# EAGLE design Artembed_SMALL (EAGLE 9.5.0)
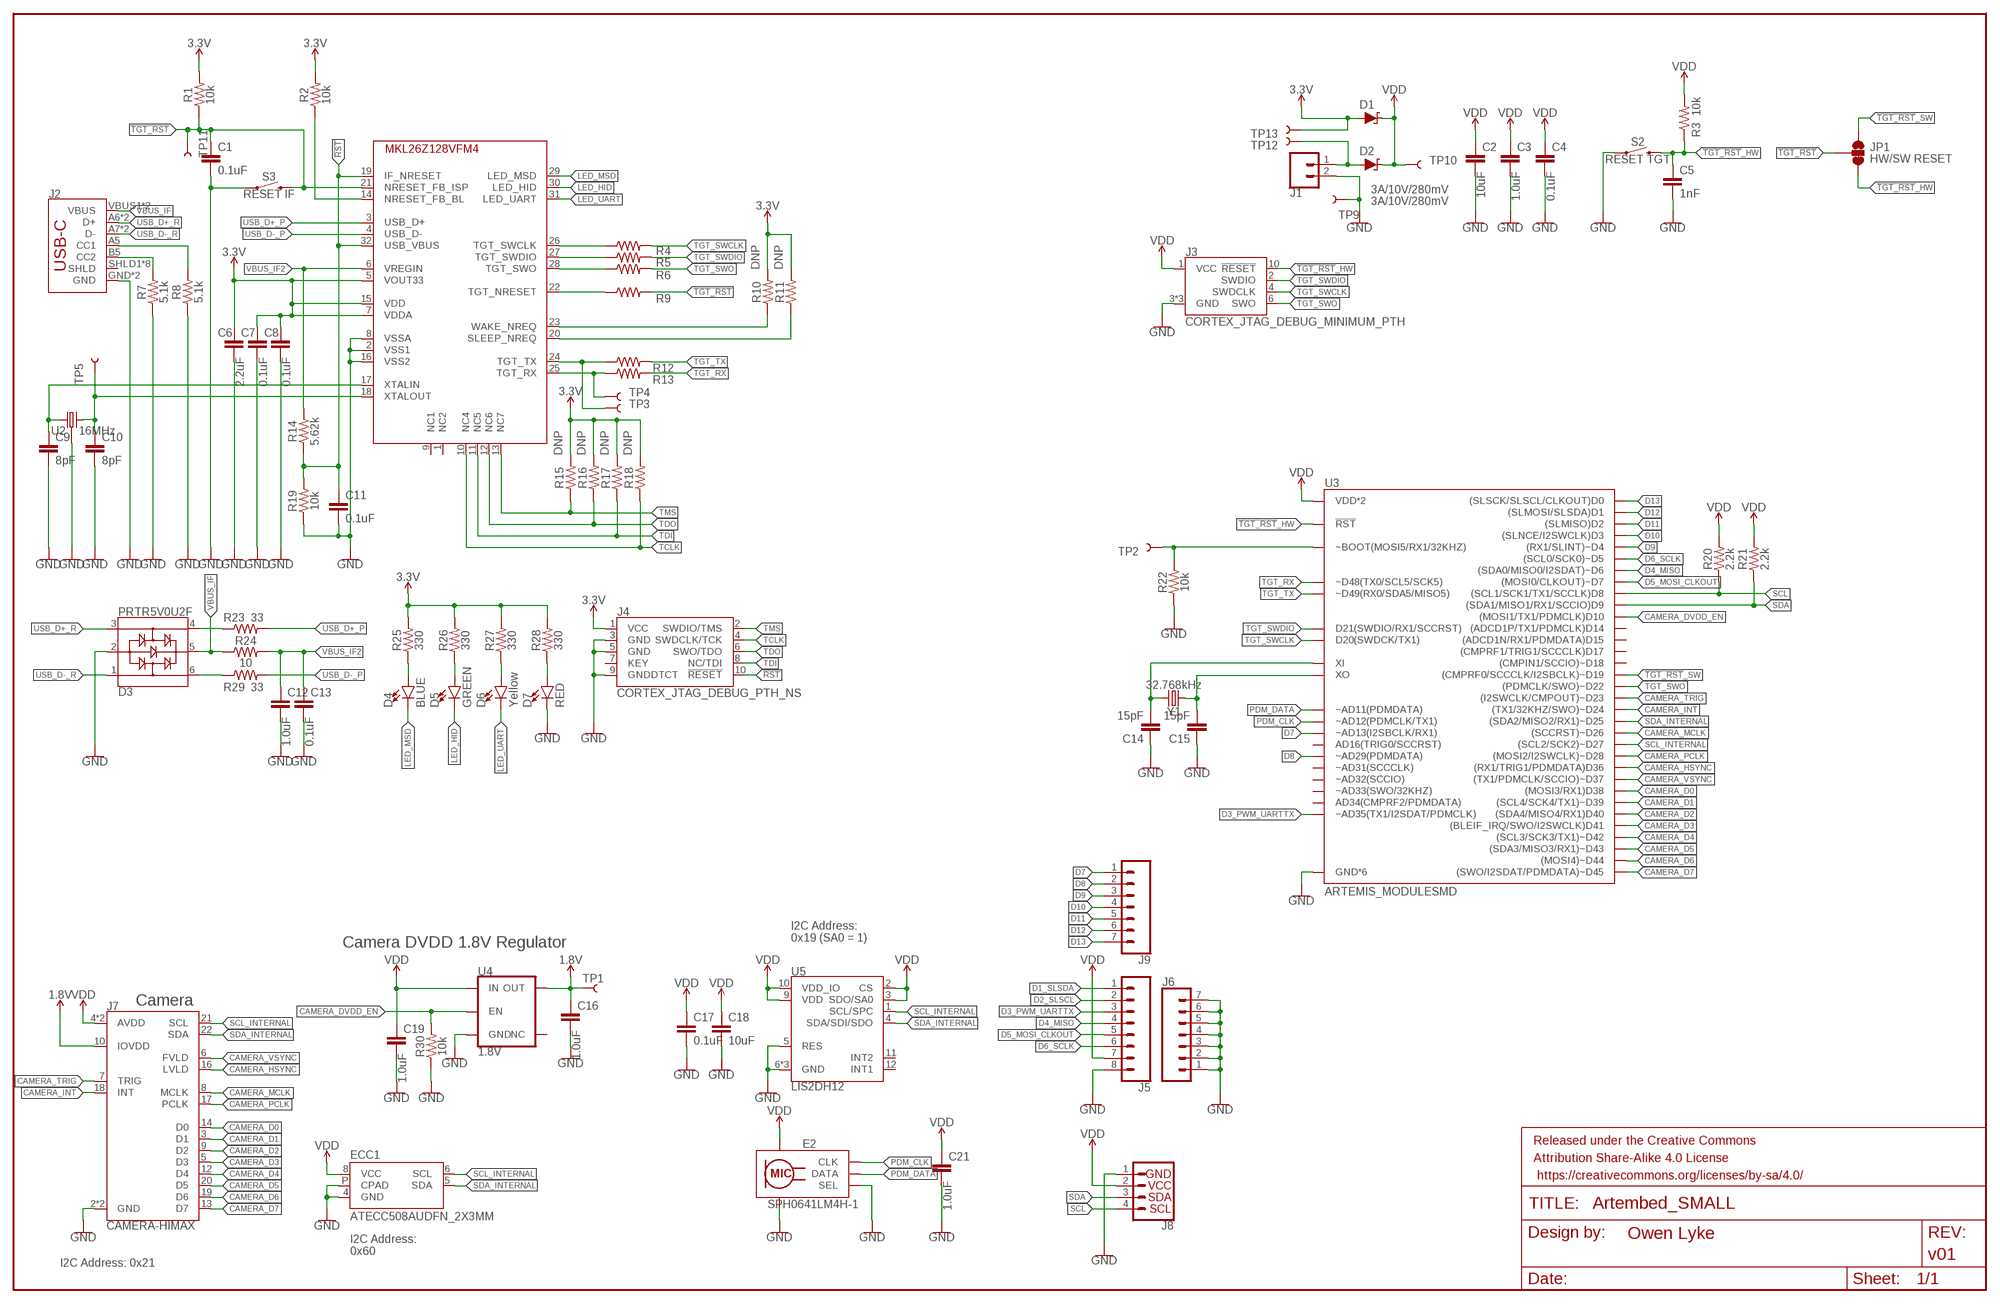
[diagram p0: schematic, sheet 1]

## Parts
C1  0.1uF  0.1UF-0603-25V-5%  [0603]
C2  10uF  10UF-0603-6.3V-20%  [0603]
C3  1.0uF  1.0UF-0603-16V-10%  [0603]
C4  0.1uF  0.1UF-0603-25V-5%  [0603]
C5  1nF  1.0NF/1000PF-0603-50V-10%  [0603]
C6  2.2uF  2.2UF-0603-10V-20%  [0603]
C7  0.1uF  0.1UF-0603-25V-5%  [0603]
C8  0.1uF  0.1UF-0603-25V-5%  [0603]
C9  8pF  CAP-0603  [0603]
C10  8pF  CAP-0603  [0603]
C11  0.1uF  0.1UF-0603-25V-5%  [0603]
C12  1.0uF  1.0UF-0603-16V-10%  [0603]
C13  0.1uF  0.1UF-0603-25V-5%  [0603]
C14  15pF  15PF-0603-50V-5%  [0603]
C15  15pF  15PF-0603-50V-5%  [0603]
C16  1.0uF  1.0UF-0603-16V-10%  [0603]
C17  0.1uF  0.1UF-0603-25V-5%  [0603]
C18  10uF  10UF-0603-6.3V-20%  [0603]
C19  1.0uF  1.0UF-0603-16V-10%  [0603]
C21  1.0uF  1.0UF-0603-16V-10%  [0603]
D1  3A/10V/280mV  DIODE-SCHOTTKY-BAT60A  [SOD-323]
D2  3A/10V/280mV  DIODE-SCHOTTKY-BAT60A  [SOD-323]
D3  PRTR5V0U2F  [SOT886]
D4  BLUE  LED-BLUE0603  [LED-0603]
D5  GREEN  LED-GREEN0603  [LED-0603]
D6  Yellow  LED-YELLOW0603  [LED-0603]
D7  RED  LED-RED0603  [LED-0603]
E2  SPH0641LM4H-1  SPH0641LM4H-1_MICROPHONE  [SPH0641LM4H-1_MICROPHONE]
ECC1  ATECC508AUDFN_2X3MM  [UDFN_2X3MM]
FRAME1  FRAME-LEDGER  [CREATIVE_COMMONS]
J1  CONN_02-JST-2MM-SMT  [JST-2-SMD]
J2  USB_C2-LAYER  [USB-C-16P]
J3  CORTEX_JTAG_DEBUG_MINIMUM_PTH  [2X5-PTH-1.27MM]
J4  CORTEX_JTAG_DEBUG_PTH_NS  [2X5-PTH-1.27MM-NO_SILK]
J5  CONN_08NO_SILK_FEMALE_PTH  [1X08_NO_SILK]
J6  CONN_07NO_SILK  [1X07_NO_SILK]
J7  CAMERA-HIMAX  [FPC-24-AMPHENOL-SFV24R-1STE1HLF]
J8  QWIIC_CONNECTORJS-1MM  [JST04_1MM_RA]
J9  CONN_07NO_SILK  [1X07_NO_SILK]
JP1  HW/SW RESET  JUMPER-SMT_3_1-NC_TRACE_SILK  [SMT-JUMPER_3_1-NC_TRACE_SILK]
R1  10k  10KOHM-0603-1/10W-1%  [0603]
R2  10k  10KOHM-0603-1/10W-1%  [0603]
R3  10k  10KOHM-0603-1/10W-1%  [0603]
R4  0  0OHM-0603-1/10W  [0603]
R5  0  0OHM-0603-1/10W  [0603]
R6  0  0OHM-0603-1/10W  [0603]
R7  5.1k  5.1KOHM5.1KOHM-0603-1/10W-1%  [0603]
R8  5.1k  5.1KOHM5.1KOHM-0603-1/10W-1%  [0603]
R9  0  0OHM-0603-1/10W  [0603]
R10  DNP  RESISTOR0603  [0603]
R11  DNP  RESISTOR0603  [0603]
R12  0  0OHM-0603-1/10W  [0603]
R13  0  0OHM-0603-1/10W  [0603]
R14  5.62k  5.62KOHM-0603-1/10W-1%  [0603]
R15  DNP  RESISTOR0603  [0603]
R16  DNP  RESISTOR0603  [0603]
R17  DNP  RESISTOR0603  [0603]
R18  DNP  RESISTOR0603  [0603]
R19  10k  10KOHM-0603-1/10W-1%  [0603]
R20  2.2k  2.2KOHM-0603-1/10W-1%  [0603]
R21  2.2k  2.2KOHM-0603-1/10W-1%  [0603]
R22  10k  10KOHM-0603-1/10W-1%  [0603]
R23  33  33OHM-0603-1/10W-1%  [0603]
R24  10  10OHM-0603-1/10W-1%  [0603]
R25  330  330OHM-0603-1/10W-1%  [0603]
R26  330  330OHM-0603-1/10W-1%  [0603]
R27  330  330OHM-0603-1/10W-1%  [0603]
R28  330  330OHM-0603-1/10W-1%  [0603]
R29  33  33OHM-0603-1/10W-1%  [0603]
R30  10k  10KOHM-0603-1/10W-1%  [0603]
S2  RESET TGT  MOMENTARY-SWITCH-SPST-SMD-4.6X2.8MM  [TACTILE_SWITCH_SMD_4.6X2.8MM]
S3  RESET IF  MOMENTARY-SWITCH-SPST-SMD-4.6X2.8MM  [TACTILE_SWITCH_SMD_4.6X2.8MM]
TP1  TEST-POINT3X5  [PAD.03X.05]
TP2  TEST-POINT3X5  [PAD.03X.05]
TP3  TEST-POINT3X5  [PAD.03X.05]
TP4  TEST-POINT3X5  [PAD.03X.05]
TP5  TEST-POINT3X5  [PAD.03X.05]
TP9  TEST-POINT3X5  [PAD.03X.05]
TP10  TEST-POINT3X5  [PAD.03X.05]
TP11  TEST-POINT3X5  [PAD.03X.05]
TP12  TEST-POINT3X5  [PAD.03X.05]
TP13  TEST-POINT3X5  [PAD.03X.05]
U1  DAPLINK_KL26Z  [QFN-32-NOPAD]
U2  16MHz  CRYSTAL-16MHZ_SMALL  [CRYSTAL-SMD-3.2X2.5MM]
U3  ARTEMIS_MODULESMD  [ARTEMIS_FP]
U4  1.8V  V_REG_AP2127K-1.8V  [SOT23-5]
U5  LIS2DH12  [LGA-12-LISDH12]
Y1  32.768kHz  CRYSTAL-32.768KHZSMD-3.2X1.5  [CRYSTAL-SMD-3.2X1.5MM]

## Nets
1.8V: C16.1 J7.10(IOVDD) TP1.P$1 U4.5(OUT)
3.3V: C6.1 C7.1 C8.1 D1.A J4.1(VCC) R1.2 R2.2 R10.2 R11.2 R15.2 R16.2 R17.2 R18.2 R25.2 R26.2 R27.2 R28.2 TP13.P$1 U1.5(VOUT33) U1.7(VDDA) U1.15(VDD)
!RST: C11.1 J4.10(!RESET) R14.1 R19.2 U1.19(IF_NRESET) U1.32(USB_VBUS)
!TGT_RST: C1.1 JP1.2 R1.1 R9.2 S3.3 S3.4 TP11.P$1 U1.21(NRESET_FB_ISP)
!TGT_RST!_HW: C5.1 J3.10(!RESET) JP1.3 R3.1 S2.3 S2.4 U3.~RST(!RST)
!TGT_RST!_SW: JP1.1 U3.~D19((CMPRF0/SCCCLK/I2SBCLK)~D19)
CAMERA_D0: J7.14(D0) U3.D38((MOSI3/RX1)D38)
CAMERA_D1: J7.3(D1) U3.~D39((SCL4/SCK4/TX1)~D39)
CAMERA_D2: J7.9(D2) U3.D40((SDA4/MISO4/RX1)D40)
CAMERA_D3: J7.5(D3) U3.D41((BLEIF_IRQ/SWO/I2SWCLK)D41)
CAMERA_D4: J7.12(D4) U3.~D42((SCL3/SCK3/TX1)~D42)
CAMERA_D5: J7.20(D5) U3.~D43((SDA3/MISO3/RX1)~D43)
CAMERA_D6: J7.19(D6) U3.~D44((MOSI4)~D44)
CAMERA_D7: J7.13(D7) U3.~D45((SWO/I2SDAT/PDMDATA)~D45)
CAMERA_DVDD_EN: R30.2 U3.D10((MOSI1/TX1/PDMCLK)D10) U4.3(EN)
CAMERA_HSYNC: J7.16(LVLD) U3.D36((RX1/TRIG1/PDMDATA)D36)
CAMERA_INT: J7.18(INT) U3.~D24((TX1/32KHZ/SWO)~D24)
CAMERA_MCLK: J7.8(MCLK) U3.~D26((SCCRST)~D26)
CAMERA_PCLK: J7.17(PCLK) U3.~D28((MOSI2/I2SWCLK)~D28)
CAMERA_TRIG: J7.7(TRIG) U3.~D23((I2SWCLK/CMPOUT)~D23)
CAMERA_VSYNC: J7.6(FVLD) U3.~D37((TX1/PDMCLK/SCCIO)~D37)
D1_SLSDA: J5.1
D2_SLSCL: J5.2
D3_PWM_UARTTX: J5.3 U3.~AD35(~AD35(TX1/I2SDAT/PDMCLK))
D4_MISO: J5.4 U3.~D6((SDA0/MISO0/I2SDAT)~D6)
D5_MOSI_CLKOUT: J5.5 U3.D7((MOSI0/CLKOUT)~D7)
D6_SCLK: J5.6 U3.~D5((SCL0/SCK0)~D5)
D7: J9.1 U3.~AD13(~AD13(I2SBCLK/RX1))
D8: J9.2 U3.~AD29(~AD29(PDMDATA))
D9: J9.3 U3.~D4((RX1/SLINT)~D4)
D10: J9.4 U3.D3((SLNCE/I2SWCLK)D3)
D11: J9.5 U3.D2((SLMISO)D2)
D12: J9.6 U3.D1((SLMOSI/SLSDA)D1)
D13: J9.7 U3.D0((SLSCK/SLSCL/CLKOUT)D0)
GND: C1.2 C2.2 C3.2 C4.2 C5.2 C6.2 C7.2 C8.2 C9.2 C10.2 C11.2 C12.2 C13.2 C14.1 C15.1 C16.2 C17.2 C18.2 C19.2 C21.2 D3.2 D7.C E2.2(SEL) E2.3(GND) E2.6(GND) E2.7(GND) E2.8(GND) ECC1.4(GND) ECC1.P(CPAD) J1.2 J2.GND J2.GND2(GND) J3.3(GND) J3.5(GND) J3.9(GND) J4.3(GND) J4.5(GND) J4.9(GNDDTCT) J5.8 J6.1 J6.2 J6.3 J6.4 J6.5 J6.6 J6.7 J7.2(GND) J7.15(GND) J8.1 R7.1 R8.1 R19.1 R22.1 R30.1 S2.1 S2.2 S3.1 S3.2 TP9.P$1 U1.2(VSS1) U1.8(VSSA) U1.16(VSS2) U2.2(GND) U2.4(GND) U3.GND@1(GND*6) U3.GND@22(GND*6) U3.GND@38(GND*6) U3.GND@39(GND*6) U3.GND@47(GND*6) U3.GND@59(GND*6) U4.2(GND) U5.5(RES) U5.6(GND) U5.7(GND) U5.8(GND)
LED_HID: D5.C U1.30(LED_HID)
LED_MSD: D4.C U1.29(LED_MSD)
LED_UART: D6.C U1.31(LED_UART)
N$1: D4.A R25.1
N$2: D5.A R26.1
N$3: D6.A R27.1
N$4: J2.B5(CC2) R7.2
N$5: J2.A5(CC1) R8.2
N$7: D7.A R28.1
N$8: D3.4 R23.1
N$9: D3.6 R29.1
N$10: R2.1 U1.14(NRESET_FB_BL)
N$11: R11.1 U1.20(SLEEP_NREQ)
N$13: C9.1 U1.17(XTALIN) U2.1
N$14: C14.2 U3.XI Y1.P$2
N$15: C15.2 U3.XO Y1.P$1
N$16: C10.1 TP5.P$1 U1.18(XTALOUT) U2.3
N$17: R12.1 TP3.P$1 U1.24(TGT_TX)
N$18: R13.1 TP4.P$1 U1.25(TGT_RX)
N$19: R10.1 U1.23(WAKE_NREQ)
N$20: R22.2 TP2.P$1 U3.BOOT(~BOOT(MOSI5/RX1/32KHZ))
N$21: D2.A J1.1 TP12.P$1
N$22: R9.1 U1.22(TGT_NRESET)
N$23: R4.1 U1.26(TGT_SWCLK)
N$24: R5.1 U1.27(TGT_SWDIO)
N$25: R6.1 U1.28(TGT_SWO)
PDM_CLK: E2.4(CLK) U3.~AD12(~AD12(PDMCLK/TX1))
PDM_DATA: E2.1(DATA) U3.~AD11(~AD11(PDMDATA))
SCL: J8.4 R20.1 U3.D8((SCL1/SCK1/TX1/SCCLK)D8)
SCL_INTERNAL: ECC1.6(SCL) J7.21(SCL) U3.~D27((SCL2/SCK2)~D27) U5.1(SCL/SPC)
SDA: J8.3 R21.1 U3.D9((SDA1/MISO1/RX1/SCCIO)D9)
SDA_INTERNAL: ECC1.5(SDA) J7.22(SDA) U3.~D25((SDA2/MISO2/RX1)~D25) U5.4(SDA/SDI/SDO)
TCLK: J4.4(SWDCLK/TCK) R18.1 U1.10(NC4)
TDI: J4.8(NC/TDI) R17.1 U1.11(NC5)
TDO: J4.6(SWO/TDO) R16.1 U1.12(NC6)
TGT_RX: R13.2 U3.TXO-0(~D48(TX0/SCL5/SCK5))
TGT_SWCLK: J3.4(SWDCLK) R4.2 U3.SWDCK(D20(SWDCK/TX1))
TGT_SWDIO: J3.2(SWDIO) R5.2 U3.SWDIO(D21(SWDIO/RX1/SCCRST))
TGT_SWO: J3.6(SWO) R6.2 U3.~D22((PDMCLK/SWO)~D22)
TGT_TX: R12.2 U3.RXI-0(~D49(RX0/SDA5/MISO5))
TMS: J4.2(SWDIO/TMS) R15.1 U1.13(NC7)
USB_D+_P: R23.2 U1.3(USB_D+)
USB_D+_R: D3.3 J2.A6(D+) J2.B6(D+)
USB_D-_P: R29.2 U1.4(USB_D-)
USB_D-_R: D3.1 J2.A7(D-) J2.B7(D-)
VBUS_IF: D3.5 J2.VBUS1(VBUS) J2.VBUS2(VBUS) R24.1
VBUS_IF2: C12.1 C13.1 R14.2 R24.2 U1.6(VREGIN)
VDD: C2.1 C3.1 C4.1 C17.1 C18.1 C19.1 C21.1 D1.C D2.C E2.5(VDD) ECC1.8(VCC) J3.1(VCC) J5.7 J7.4(AVDD) J7.11(AVDD) J8.2 R3.2 R20.2 R21.2 TP10.P$1 U3.VDD@36(VDD*2) U3.VDD@37(VDD*2) U4.1(IN) U5.2(CS) U5.3(SDO/SA0) U5.9(VDD) U5.10(VDD_IO)
Unconnected: J2.SHLD1(SHLD) J2.SHLD2(SHLD) J2.SHLD3(SHLD) J2.SHLD4(SHLD) J2.SHLD5(SHLD) J2.SHLD6(SHLD) J2.SHLD7(SHLD) J2.SHLD8(SHLD) J4.7(KEY) J7.MNT1@0(MNT1) J7.MNT1@1(MNT1) J7.MNT2@0(MNT2) J7.MNT2@1(MNT2) U1.1(NC2) U1.9(NC1) U3.AD16(AD16(TRIG0/SCCRST)) U3.AD34(AD34(CMPRF2/PDMDATA)) U3.D14((ADCD1P/TX1/PDMCLK)D14) U3.D15((ADCD1N/RX1/PDMDATA)D15) U3.D17((CMPRF1/TRIG1/SCCCLK)D17) U3.~AD31(~AD31(SCCCLK)) U3.~AD32(~AD32(SCCIO)) U3.~AD33/SWO(~AD33(SWO/32KHZ)) U3.~D18((CMPIN1/SCCIO)~D18) U4.4(NC) U5.11(INT2) U5.12(INT1)

## Notes on the sheet
- Camera DVDD 1.8V Regulator
- I2C Address:
  0x19 (SA0 = 1)
- Camera
- I2C Address:
  0x60
- I2C Address: 0x21

## Library data of the parts
C1 C4 C7 C8 C11 C13 C17 = SparkFun-Capacitors:0.1UF: 0.1µF ceramic capacitors A capacitor is a passive two-terminal electrical component used to store electrical energy temporarily in an electric field.; PROD_ID: CAP-08604
C2 C18 = SparkFun-Capacitors:10UF: 10.0µF ceramic capacitors A capacitor is a passive two-terminal electrical component used to store electrical energy temporarily in an electric field.; PROD_ID: CAP-11015
C3 C12 C16 C19 C21 = SparkFun-Capacitors:1.0UF: 1µF ceramic capacitors A capacitor is a passive two-terminal electrical component used to store electrical energy temporarily in an electric field.; PROD_ID: CAP-00868
C5 = SparkFun-Capacitors:1.0NF/1000PF: 1nF/1,000pF ceramic capacitors A capacitor is a passive two-terminal electrical component used to store electrical energy temporarily in an electric field.; PROD_ID: CAP-07886
C6 = SparkFun-Capacitors:2.2UF: 2.2µF ceramic capacitors A capacitor is a passive two-terminal electrical component used to store electrical energy temporarily in an electric field.; PROD_ID: CAP-07888
C9 C10 = SparkFun-Capacitors:CAP
C14 C15 = SparkFun-Capacitors:15PF: 15pF ceramic capacitors A capacitor is a passive two-terminal electrical component used to store electrical energy temporarily in an electric field.; PROD_ID: CAP-07881
D1 D2 = SparkFun-DiscreteSemi:DIODE-SCHOTTKY: Schottky diode A Schottky diode is a semiconductor diode which has a low forward voltage drop and a very fast switching action.; PROD_ID: DIO-14072
D3 = SparkFun-IC-Power:PRTR5V0U2: A small ESD protection device. Most commonly used on USB D+/D- signals to protect large, expensive, or especially sensitive USB enabled devices.; PROD_ID: DIO-14084
D4 = SparkFun-LED:LED-BLUE: Blue SMD LED Used in manufacturing of various products at SparkFun Packages: 0603 - SMD 0603 package [Product Link] <http://www.digikey.com/product-detail/en/SMLE12BC7TT86/511-1589-2-ND/1641808> 1206 - SMD1206 package [Product Link] <http://www.digikey.com/product-detail/en/lite-on-inc/LTST-C150TBKT/160-1643-1-ND/573584> SparkFun Products: ESP8266 Thing-Dev Board <https://www.sparkfun.com/products/13711> RedBoard <https://www.sparkfun.com/products/12757>; PROD_ID: DIO-08575
D5 = SparkFun-LED:LED-GREEN: Green SMD LED Used in manufacturing of various products at SparkFun Packages: 0603 - SMD 0603 package [Product Link] <http://www.futureelectronics.com/en/technologies/semiconductors/optoelectronics/leds/Pages/9894312-LTST-C190GKT.aspx?CrossPart=HSMG-C190&IM=0> LilyPad 1206 - SMD1206 LilyPad package [Product Link] <http://www.futureelectronics.com/en/Technologies/Product.aspx?ProductID=IN150NGHARVATEKCORPORATION2049943&IM=0> 1206 - SMD1206 package [Product Link] <http://www.futureelectronics.com/en/technologies/semiconductors/optoelectronics/leds/Pages/8315665-LTST-C150KGKT.aspx?IM=0> 1206 Bottom Mount -SMD 1206 Bottom Mount [Product Link] <http://www.digikey.com/product-detail/en/lite-on-inc/LTST-C230KGKT/160-1456-1-ND/386854> SparkFun Products: Pro Mini 328 -5V <https://www.sparkfun.com/products/821> RedBoard <https://www.sparkfun.com/products/12757> MP3 Trigger <https://www.sparkfun.com/products/13720> Makey Makey <https://www.sparkfun.com/products/11076>; PROD_ID: DIO-00821
D6 = SparkFun-LED:LED-YELLOW: Yellow SMD LED Used in manufacturing several products at SparkFun. Packages: 0603 - SMD 0603 package[Product Link] <http://www.kingbrightusa.com/product.asp?catalog_name=LED&product_id=APT1608SYCK> 0603 -SMART - SMART SMD 0603 package (more efficient/more expensive) [Product Link] <http://www.osram-os.com/osram_os/en/products/product-catalog/led-light-emitting-diodes/smartled-0603/ly-l29k/index.jsp> LilyPad - SMD1206 package[Product Datasheet] <https://www.sparkfun.com/datasheets/DevTools/LilyPad/Q150YUS4.pdf> SparkFun Products: Blynk Board <https://www.sparkfun.com/products/13794> IOIO-OTG <https://www.sparkfun.com/products/13613> XBee Explorer Serial <https://www.sparkfun.com/products/13225>; PROD_ID: DIO-09003
D7 = SparkFun-LED:LED-RED: Red SMD LED Used in manufacturing of most products at SparkFun Packages: 0603 - SMD 0603 package [Product Link] <http://docs.avagotech.com/docs/AV02-0551EN> 0603 SMART - SMD 0603 SMART package ( more efficient and expensive)[Product Link] <http://www.osram-os.com/Graphics/XPic2/00077099_0.pdf> 1206 - SMD1206 package [Product Link] <https://www.sparkfun.com/datasheets/DevTools/LilyPad/Q150OVS4.pdff> SparkFun Products: Pro Mini 328 -5V <https://www.sparkfun.com/products/821> RedBoard <https://www.sparkfun.com/products/12757> IOIO-OTG <https://www.sparkfun.com/products/13613>; PROD_ID: DIO-00819
E2 = SparkFun-Sensors:SPH0641LM4H-1_MICROPHONE: SPH0641LM4H-1 Microphone A miniature, high-performance, low power, bottom port silicon digital microphone with a single bit PDM output.; PROD_ID: IC-14361
ECC1 = ATECC508A:ATECC508A: ATECC508A CryptoAuthentication Device Cryptographic Co-processor with Secure Hardware-Based Key Storage ECDSA: FIPS186-3 Elliptic Curve Digital Signature Algorithm ECDH: FIPS SP800-56A Elliptic Curve Diffie-Hellman Algorithm NIST Standard P256 Elliptic Curve Support SHA-256 Hash Algorithm with HMAC Option 1 MHz Standard I2C Interface 2.0V to 5.5V Supply Voltage Range 1.8V to 5.5V IO levels Datasheet <http://ww1.microchip.com/downloads/en/DeviceDoc/20005927A.pdf> SparkFun Products Qwiic IoT Security ATECC508A <https://www.sparkfun.com/products/XXXXX> (DEV-XXXXX)
FRAME1 = SparkFun-Aesthetics:FRAME-LEDGER: Schematic Frame - Ledger Standard 11x14 US Ledger frame; DESIGNER: Owen Lyke; REV: v01
J1 = SparkFun-Connectors:CONN_02: Multi connection point. Often used as Generic Header-pin footprint for 0.1 inch spaced/style header connections On any of the 0.1 inch spaced packages, you can populate with these: Break Away Headers - Straight <https://www.sparkfun.com/products/116> (PRT-00116) Break Away Male Headers - Right Angle <https://www.sparkfun.com/products/553> (PRT-00553) Female Headers <https://www.sparkfun.com/products/115> (PRT-00115) Break Away Headers - Machine Pin <https://www.sparkfun.com/products/117> (PRT-00117) Break Away Female Headers - Swiss Machine Pin <https://www.sparkfun.com/products/743> (PRT-00743) For SCREWTERMINALS and SPRING TERMINALS visit here: Screw Terimnals on SparkFun.com <https://www.sparkfun.com/search/results?term=Screw+Terminals> (5mm/3.5mm/2.54mm spacing) This device is also useful as a general connection point to wire up your design to another part of your project. Our various solder wires solder well into these plated through hole pads. Hook-Up Wire - Assortment (Stranded, 22 AWG) <https://www.sparkfun.com/products/11375> (PRT-11375) Hook-Up Wire - Assortment (Solid Core, 22 AWG) <https://www.sparkfun.com/products/11367> (PRT-11367) View the entire wire category on our website here <https://www.sparkfun.com/categories/141> Special notes: Molex polarized connector foot print use with: PRT-08233 with associated crimp pins and housings. 2.54_SCREWTERM for use with PRT-10571. 3.5mm Screw Terminal footprints for PRT-08084 5mm Screw Terminal footprints for use with PRT-08432; PROD_ID: CONN-11443
J2 = SparkFun-Connectors:USB_C: USB Type C 16Pin Connector Super Speed pins not available on the 16-pin purely SMD connector so this part is best for USB 2.0 implementations. D1 and D2 are tied together enabling D+/- no matter which way the cable is plugged into the connector. The two channel configuration pins (CC1/2) are exposed. These are normally connected to ground via 5.1k resistors but can be reconfigured for high current/high power applications.; PROD_ID: CONN-14122
J3 = SparkFun-Connectors:CORTEX_JTAG_DEBUG_MINIMUM: Cortex Debug Connector - 10 pin Supports JTAG debug, Serial Wire debug, and Serial Wire Viewer. PTH and SMD connector options available. General Connector Information <http://infocenter.arm.com/help/topic/com.arm.doc.faqs/attached/13634/cortex_debug_connectors.pdf> Products: PTH Connector <http://www.digikey.com/product-detail/en/cnc-tech/3220-10-0100-00/1175-1627-ND/3883661> -via Digi-Key SparkFun PSoc <https://www.sparkfun.com/products/13229> SparkFun T <https://www.sparkfun.com/products/13810>
J4 = SparkFun-Connectors:CORTEX_JTAG_DEBUG: Cortex Debug Connector - 10 pin Supports JTAG debug, Serial Wire debug, and Serial Wire Viewer. PTH and SMD connector options available. General Connector Information <http://infocenter.arm.com/help/topic/com.arm.doc.faqs/attached/13634/cortex_debug_connectors.pdf> Products: PTH Connector <http://www.digikey.com/product-detail/en/cnc-tech/3220-10-0100-00/1175-1627-ND/3883661> -via Digi-Key SparkFun PSoc <https://www.sparkfun.com/products/13229> SparkFun T <https://www.sparkfun.com/products/13810>
J5 = SparkFun-Connectors:CONN_08: Multi connection point. Often used as Generic Header-pin footprint for 0.1 inch spaced/style header connections On any of the 0.1 inch spaced packages, you can populate with these: Break Away Headers - Straight <https://www.sparkfun.com/products/116> (PRT-00116) Break Away Male Headers - Right Angle <https://www.sparkfun.com/products/553> (PRT-00553) Female Headers <https://www.sparkfun.com/products/115> (PRT-00115) Break Away Headers - Machine Pin <https://www.sparkfun.com/products/117> (PRT-00117) Break Away Female Headers - Swiss Machine Pin <https://www.sparkfun.com/products/743> (PRT-00743) Arduino Stackable Header - 8 Pin <https://www.sparkfun.com/products/9279> (PRT-09279) For SCREWTERMINALS and SPRING TERMINALS visit here: Screw Terimnals on SparkFun.com <https://www.sparkfun.com/search/results?term=Screw+Terminals> (5mm/3.5mm/2.54mm spacing) This device is also useful as a general connection point to wire up your design to another part of your project. Our various solder wires solder well into these plated through hole pads. Hook-Up Wire - Assortment (Stranded, 22 AWG) <https://www.sparkfun.com/products/11375> (PRT-11375) Hook-Up Wire - Assortment (Solid Core, 22 AWG) <https://www.sparkfun.com/products/11367> (PRT-11367) View the entire wire category on our website here <https://www.sparkfun.com/categories/141> Special notes: Molex polarized connector foot print use with SKU : PRT-08231 with associated crimp pins and housings. 1MM SMD Version SKU: PRT-10208 NOTES ON THE VARIANTS LOCK and LOCK_LONGPADS... This footprint was designed to help hold the alignment of a through-hole component (i.e. 6-pin header) while soldering it into place. You may notice that each hole has been shifted either up or down by 0.005 of an inch from it's more standard position (which is a perfectly straight line). This slight alteration caused the pins (the squares in the middle) to touch the edges of the holes. Because they are alternating, it causes a "brace" to hold the component in place. 0.005 has proven to be the perfect amount of "off-center" position when using our standard breakaway headers. Although looks a little odd when you look at the bare footprint, once you have a header in there, the alteration is very hard to notice. Also,if you push a header all the way into place, it is covered up entirely on the bottom side.; PROD_ID: CONN-08438
J6 J9 = SparkFun-Connectors:CONN_07: Multi connection point. Often used as Generic Header-pin footprint for 0.1 inch spaced/style header connections On any of the 0.1 inch spaced packages, you can populate with these: Break Away Headers - Straight <https://www.sparkfun.com/products/116> (PRT-00116) Break Away Male Headers - Right Angle <https://www.sparkfun.com/products/553> (PRT-00553) Female Headers <https://www.sparkfun.com/products/115> (PRT-00115) Break Away Headers - Machine Pin <https://www.sparkfun.com/products/117> (PRT-00117) Break Away Female Headers - Swiss Machine Pin <https://www.sparkfun.com/products/743> (PRT-00743) For SCREWTERMINALS and SPRING TERMINALS visit here: Screw Terimnals on SparkFun.com <https://www.sparkfun.com/search/results?term=Screw+Terminals> (5mm/3.5mm/2.54mm spacing) This device is also useful as a general connection point to wire up your design to another part of your project. Our various solder wires solder well into these plated through hole pads. Hook-Up Wire - Assortment (Stranded, 22 AWG) <https://www.sparkfun.com/products/11375> (PRT-11375) Hook-Up Wire - Assortment (Solid Core, 22 AWG) <https://www.sparkfun.com/products/11367> (PRT-11367) View the entire wire category on our website here <https://www.sparkfun.com/categories/141> Special notes: Molex polarized connector foot print use with SKU : PRT-08231 with associated crimp pins and housings. 1MM SMD Version SKU: PRT-10208 NOTES ON THE VARIANTS LOCK and LOCK_LONGPADS... This footprint was designed to help hold the alignment of a through-hole component (i.e. 6-pin header) while soldering it into place. You may notice that each hole has been shifted either up or down by 0.005 of an inch from it's more standard position (which is a perfectly straight line). This slight alteration caused the pins (the squares in the middle) to touch the edges of the holes. Because they are alternating, it causes a "brace" to hold the component in place. 0.005 has proven to be the perfect amount of "off-center" position when using our standard breakaway headers. Although looks a little odd when you look at the bare footprint, once you have a header in there, the alteration is very hard to notice. Also,if you push a header all the way into place, it is covered up entirely on the bottom side.
J7 = SparkFun-Connectors:CAMERA-HIMAX; DIGIKEY: 609-4320-2-ND; PROD_ID: CONN-14233
J8 = SparkFun-Connectors:QWIIC_CONNECTOR: SparkFun I2C Standard Qwiic Connector An SMD 1mm pitch JST connector makes it easy and quick (get it? Qwiic?) to connect I2C devices to each other. The Qwiic system <http://www.sparkfun.com/qwiic> enables fast and solderless connection between popular platforms and various sensors and actuators. We carry 200mm <https://www.sparkfun.com/products/14204>, 100mm <https://www.sparkfun.com/products/14205>, 50mm <https://www.sparkfun.com/products/14206>, and breadboard friendly <https://www.sparkfun.com/products/14207> Qwiic cables. We also offer 10 pcs strips <https://www.sparkfun.com/products/14323> the SMD connectors.; PROD_ID: CONN-13694
JP1 = SparkFun-Jumpers:JUMPER-SMT_3_1-NC_TRACE: Normally closed trace jumper (1 of 2 connections) This jumper has a trace between two pads so it's normally closed (NC). The other connection is normally open (NO). Use a razor knife to open the connection. For best results follow the IPC guidelines for cutting traces: Cutout at least 0.063 mm (0.005 in). Remove all loose material to clean up the cut area. Seal the cut with an approved epoxy. Reapply solder to reclose the connection, or to close the NO connection.
R1-R3 R19 R22 R30 = SparkFun-Resistors:10KOHM: 10kΩ resistor A resistor is a passive two-terminal electrical component that implements electrical resistance as a circuit element. Resistors act to reduce current flow, and, at the same time, act to lower voltage levels within circuits. - Wikipedia; PROD_ID: RES-00824
R4-R6 R9 R12 R13 = SparkFun-Resistors:0OHM: 0Ω resistor A resistor is a passive two-terminal electrical component that implements electrical resistance as a circuit element. Resistors act to reduce current flow, and, at the same time, act to lower voltage levels within circuits. - Wikipedia; PROD_ID: RES-08609
R7 R8 = SparkFun-Resistors:5.1KOHM; PROD_ID: RES-12083
R10 R11 R15-R18 = SparkFun-Resistors:RESISTOR: Generic Resistor Package
R14 = SparkFun-Resistors:5.62KOHM: 5.62kΩ resistor A resistor is a passive two-terminal electrical component that implements electrical resistance as a circuit element. Resistors act to reduce current flow, and, at the same time, act to lower voltage levels within circuits. - Wikipedia; PROD_ID: RES-09823
R20 R21 = SparkFun-Resistors:2.2KOHM: 2.2kΩ resistor A resistor is a passive two-terminal electrical component that implements electrical resistance as a circuit element. Resistors act to reduce current flow, and, at the same time, act to lower voltage levels within circuits. - Wikipedia; PROD_ID: RES-08272
R23 R29 = SparkFun-Resistors:33OHM: 33Ω resistor A resistor is a passive two-terminal electrical component that implements electrical resistance as a circuit element. Resistors act to reduce current flow, and, at the same time, act to lower voltage levels within circuits. - Wikipedia; PROD_ID: RES-08270
R24 = SparkFun-Resistors:10OHM: 10Ω resistor A resistor is a passive two-terminal electrical component that implements electrical resistance as a circuit element. Resistors act to reduce current flow, and, at the same time, act to lower voltage levels within circuits. - Wikipedia; PROD_ID: RES-12581
R25-R28 = SparkFun-Resistors:330OHM: 330Ω resistor A resistor is a passive two-terminal electrical component that implements electrical resistance as a circuit element. Resistors act to reduce current flow, and, at the same time, act to lower voltage levels within circuits. - Wikipedia; PROD_ID: RES-00818
S2 S3 = SparkFun-Switches:MOMENTARY-SWITCH-SPST: Momentary Switch (Pushbutton) - SPST Normally-open (NO) SPST momentary switches (buttons, pushbuttons). Variants PTH-12MM - 12mm square, through-hole Momentary Pushbutton Switch - 12mm Square <https://www.sparkfun.com/products/9190> (COM-09190) PTH-6.0MM, PTH-6.0MM-KIT - 6.0mm square, through-hole Mini Pushbutton Switch <https://www.sparkfun.com/products/97> (COM-00097) KIT package intended for soldering kit's - only one side of pads' copper is exposed. PTH-RIGHT-ANGLE-KIT - Right-angle, through-hole Right Angle Tactile Button <https://www.sparkfun.com/products/10791> - Used on SparkFun BigTime Watch Kit <https://www.sparkfun.com/products/11734> SMD-12MM - 12mm square, surface-mount Tactile Button - SMD (12mm) <https://www.sparkfun.com/products/12993> (COM-12993) Used on SparkFun PicoBoard <https://www.sparkfun.com/products/11888> SMD-4.5MM - 4.5mm Square Trackball Switch Used on SparkFun Blackberry Trackballer Breakout <https://www.sparkfun.com/products/13169> SMD-4.6MMX2.8MM - 4.60mm x 2.80mm, surface mount Used on SparkFun SAMD21 Mini Breakout <https://www.sparkfun.com/products/13664> SMD-5.2MM, SMD-5.2-REDUNDANT - 5.2mm square, surface-mount Mini Pushbutton Switch - SMD <https://www.sparkfun.com/products/8720> (COM-08720) Used on Arduino Pro Mini <https://www.sparkfun.com/products/11114> REDUNDANT package connects both switch circuits together SMD-6.0X3.5MM - 6.0 x 3.5mm, surface mount Momentary Reset Switch SMD <https://www.sparkfun.com/products/8229> (COM-08229) SMD-6.2MM-TALL - 6.2mm square, surface mount Tactile Button - SMD (6mm) <https://www.sparkfun.com/products/12992> Used on SparkFun Digital Sandbox <https://www.sparkfun.com/products/12651> SMD-RIGHT-ANGLE - Right-angle, surface mount Used on SparkFun Block for Intel® Edison - Arduino <https://www.sparkfun.com/products/13036>; PROD_ID: SWCH-13065
TP1-TP5 TP9-TP13 = SparkFun-Connectors:TEST-POINT: SparkFun Test Points Bare copper test points for troubleshooting or In-Circuit-Testing. These are used by our Production team for verifying production board runs using pogo-pins on test beds. SparkFun Products: SparkFun LSM9DS1 Breakout <https://www.sparkfun.com/products/13284> SparkFun PSOC <https://www.sparkfun.com/products/13714> SparkFun Load Cell Amplifier <https://www.sparkfun.com/products/13879>
U1 = artembed:DAPLINK_KL26Z: Unfinished! This is an interface MCU that runs DAPLink to enable advanced features for the target MCU
U2 = SparkFun-Clocks:CRYSTAL-16MHZ_SMALL: 16 MHz Crystal Digikey Link <https://www.digikey.com/product-detail/en/epson/FA-20H-16.0000MF10Z-AJ5/SER4201TR-ND/7430936> Crystal Attributes: Frequency: 16 MHz Frequency Stability: +/- 10ppm Frequency Tolerance: +/- 10ppm Load Capacitance: 8pF ESR: 80 Ohms Operating Mode: Fundamental
U3 = SparkFun-IC-Microcontroller:ARTEMIS_MODULE: Description: The Artemis Module from SparkFun is a Cortex-M4F with BLE 5.0 running up to 96MHz and with as low power as 6uA per MHz (less than 5mW). This is the world's first module to bridge the market between hobbyists and consumer products. We've packaged all the power of a modern microcontroller into a module that is both extremely easy to use but is mass-market ready. The flexibility of the Artemis module starts with our [Arduino core](https://github.com/sparkfun/Arduino_Apollo3). You can program and use the Artemis module just like you would an Uno or any other Arduino. Time to first blink is just 5 minutes away! We built the core from the ground up, making it fast and as light weight as possible.; PROD_ID: SUB-14402
U4 = SparkFun-IC-Power:V_REG_AP2127: AP2127 - 300mA CMOS LDO Regulator w/ Enable The AP2127 is CMOS process low dropout linear regulator with enable function, the regulator delivers a guaranteed 300mA (min.) continuous load current. Features Output Voltage Accuracy: ±1.5% Output Current: 300mA (Min.) Foldback Short Current Protection: 50mA Enable Function to Turn ON/OFF VOUT Low Dropout Voltage (3.3V): 250mV (Typ.) @IOUT=600mA Excellent Load Regulation: 0.2%/A (Typ.) Excellent Line Regulation: 0.02%/V (Typ.) Low Quiescent Current: 55μA (Typ.) Low Standby Current: 0.01μA (Typ.) Low Output Noise: 50μVRMS PSRR: 100Hz -65dB, 1kHz -65dB OTSD Protection Stable with 1.0μF Flexible Cap: Ceramic, Tantalum and Aluminum Electrolytic Operation Temperature Range: -40°C to 85°C ESD: MM 400V, HBM 4000V; PROD_ID: VREG-14239
U5 = SparkFun-Sensors:LIS2DH12; DIGIKEY: 497-14851-2-ND; PROD_ID: IC-14229
Y1 = SparkFun-Clocks:CRYSTAL-32.768KHZ: 32.768kHz Crystal Frequency: 32.768kHz Frequency Stability: ±20ppm Load Capacitance: 12.5pF (PTH-2X6 & SMD-3.2X1.5), 6pF (SMD-2X6) SparkFun Products: SparkFun BigTime Watch Kit <https://www.sparkfun.com/products/11734> SparkFun nRF52832 Breakout <https://www.sparkfun.com/products/13990> SparkFun Real Time Clock Module <https://www.sparkfun.com/products/12708>; PROD_ID: XTAL-13062

## Board
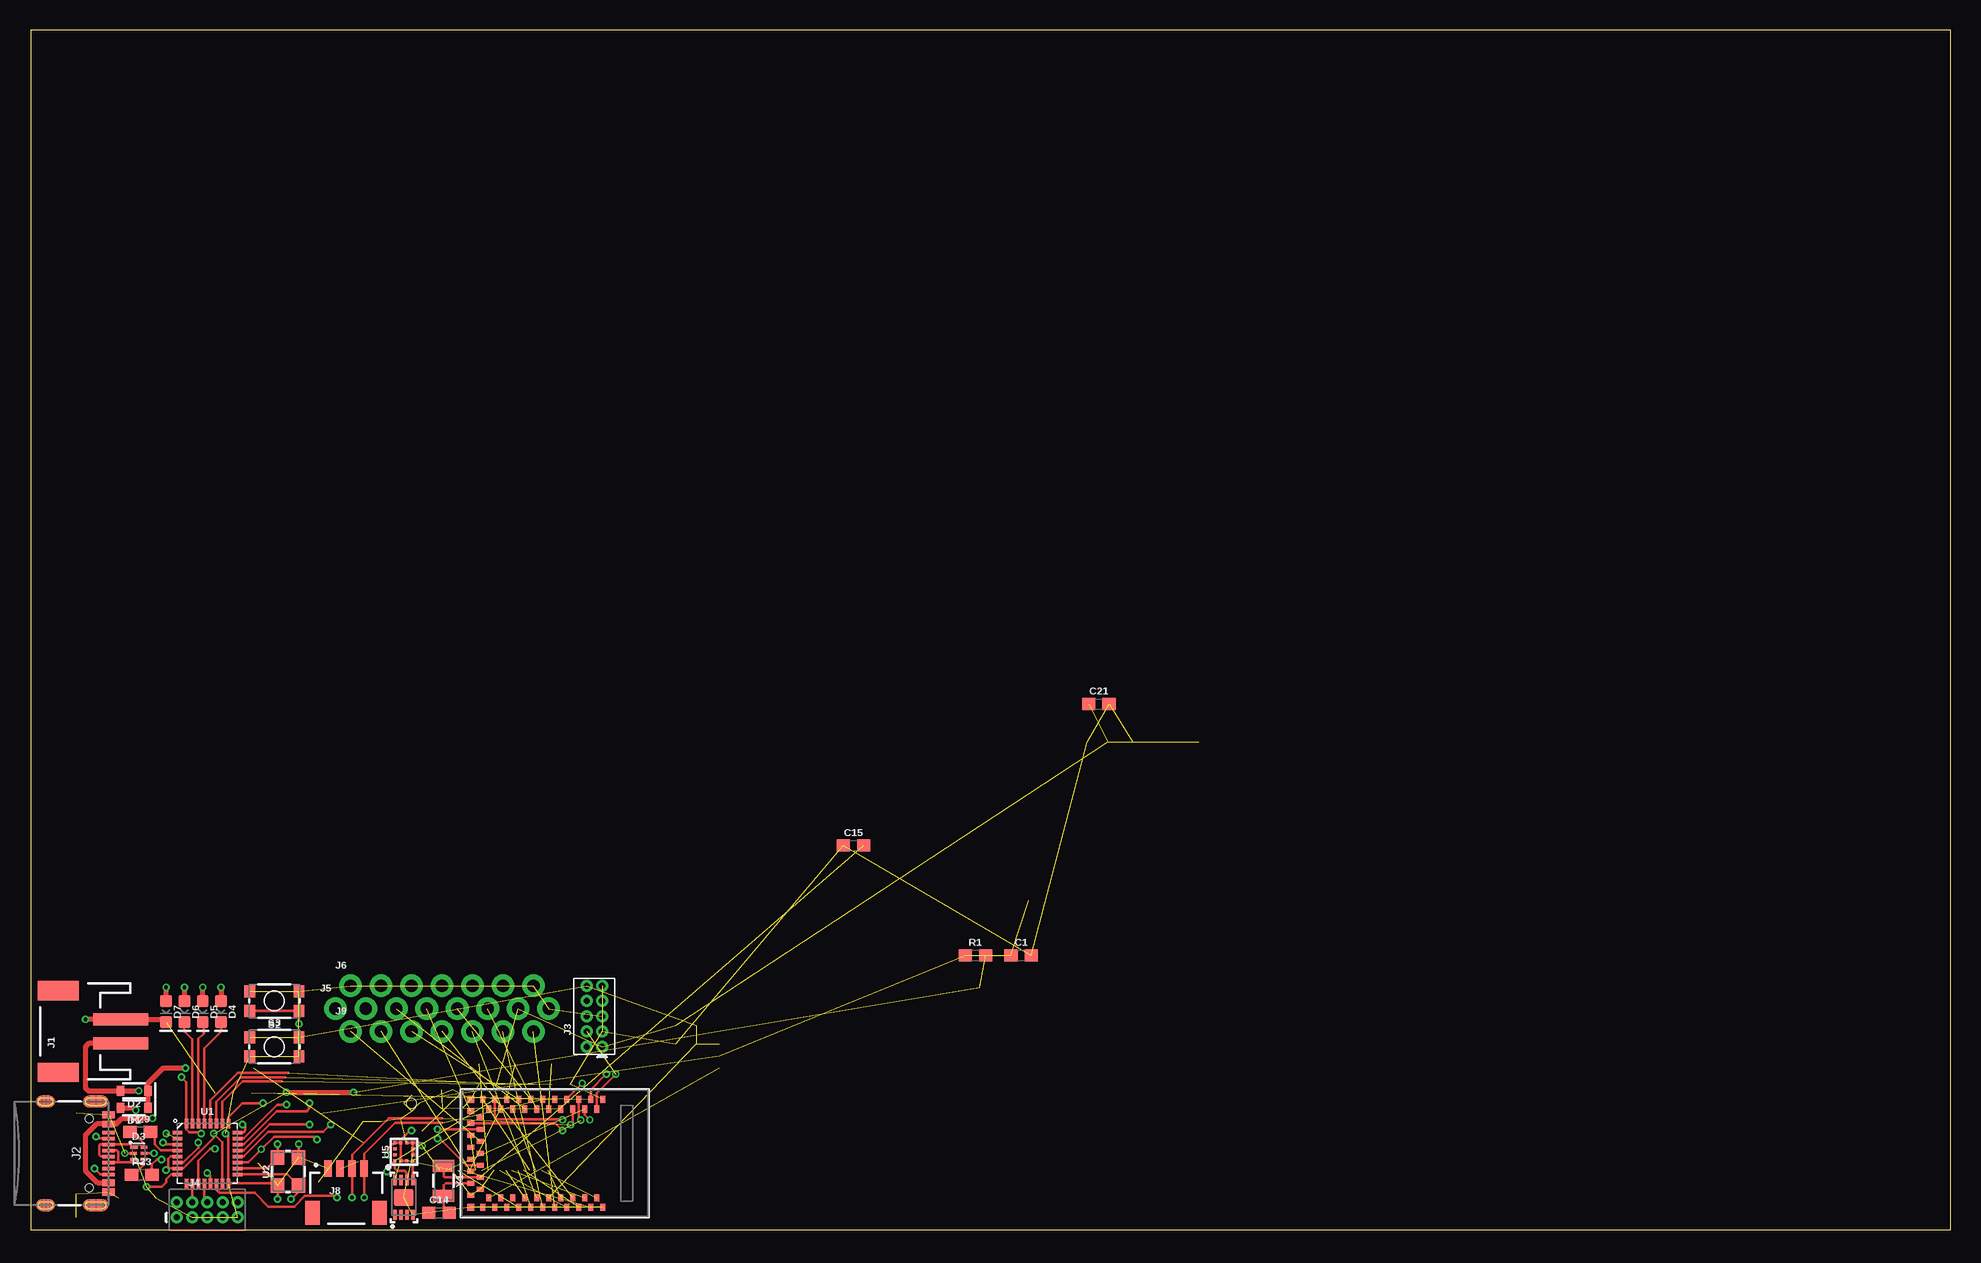
[diagram p1: board, top side]
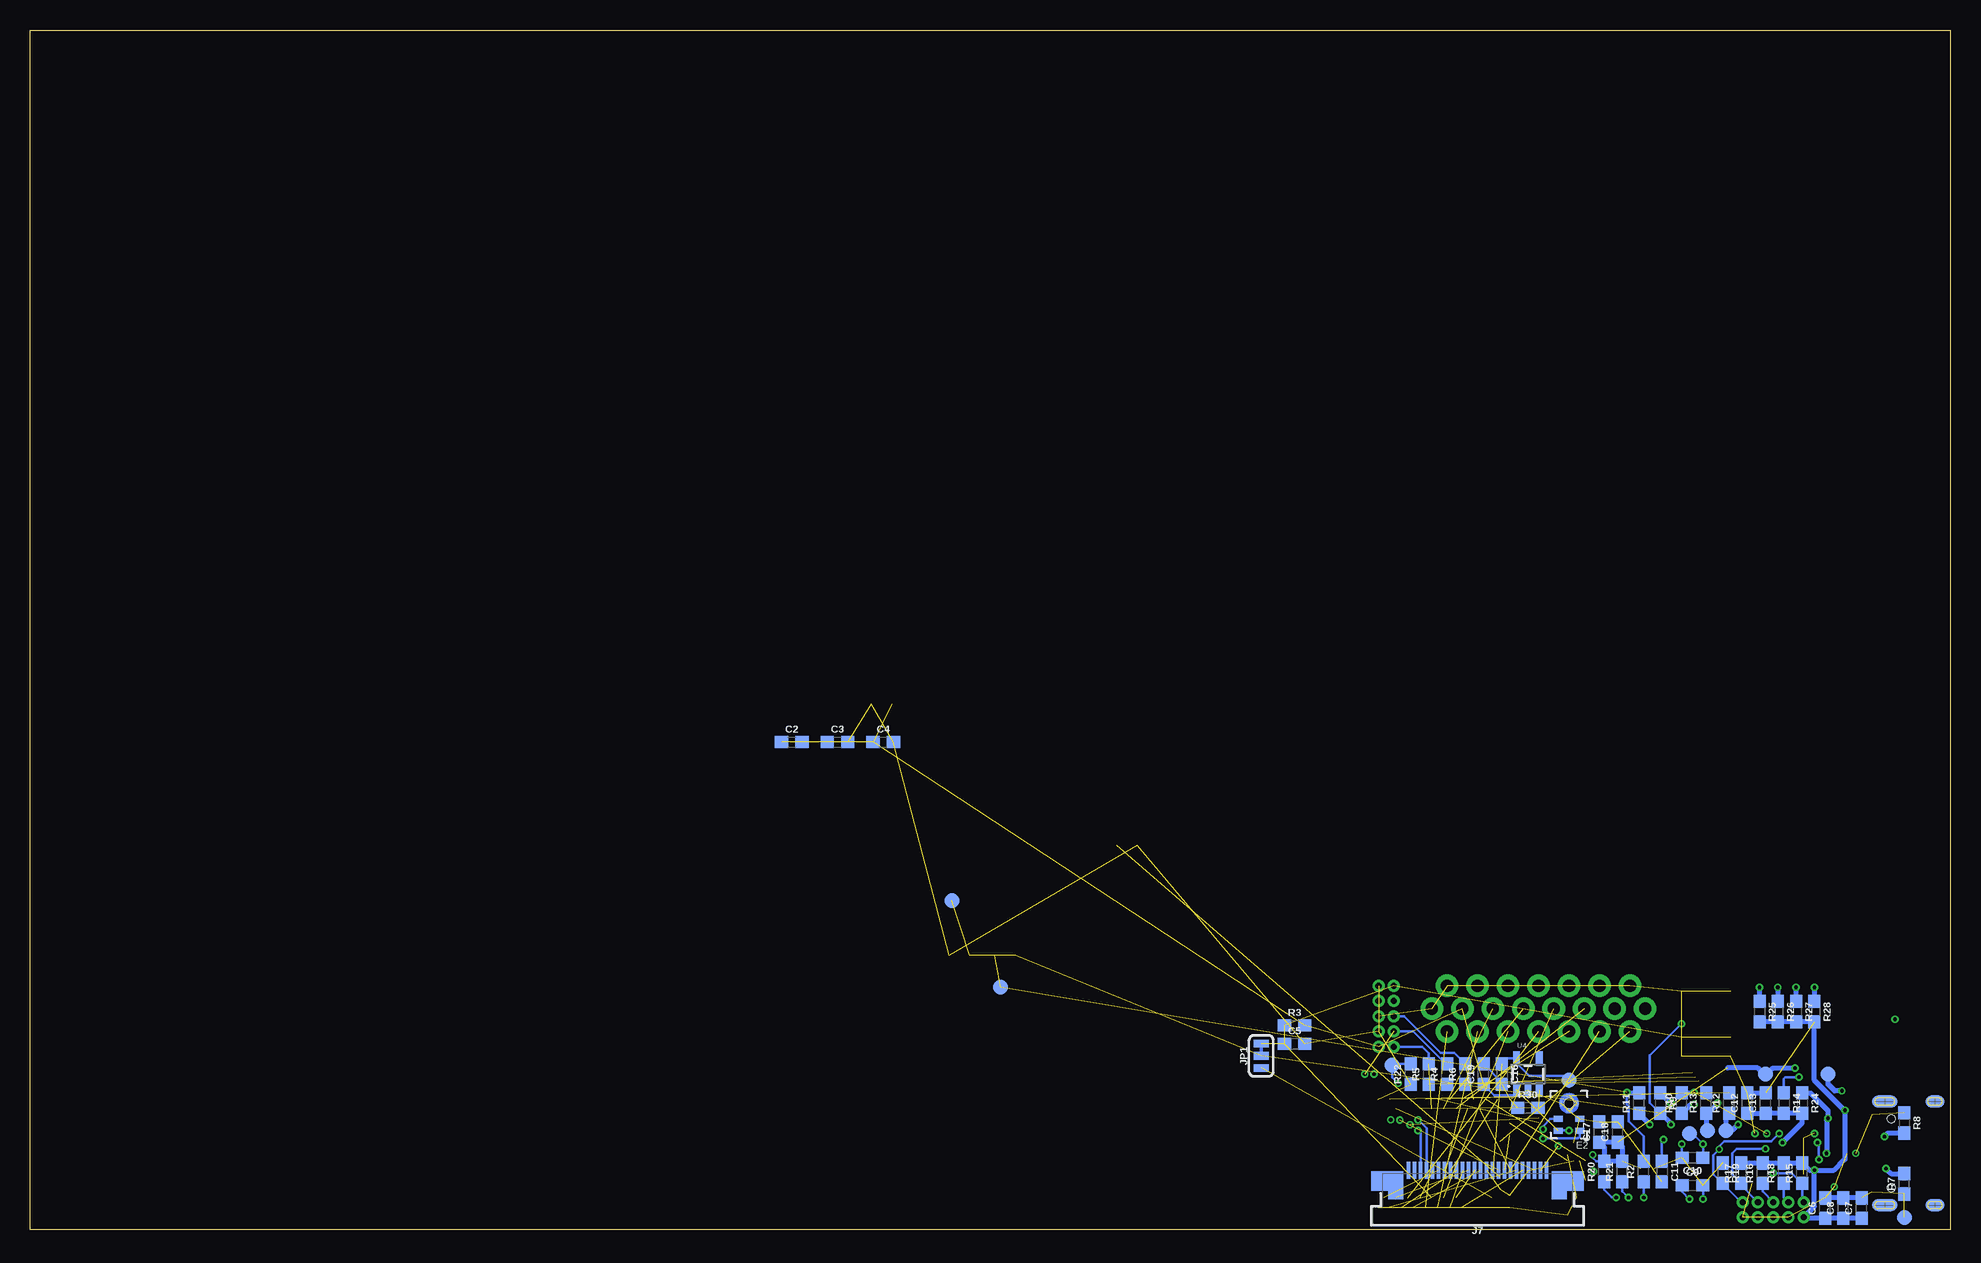
[diagram p2: board, bottom side, seen from below]

Size 160 x 100 mm. Coordinates in mm from the lower left corner, seen from the top.
Outline: 0,0 160,0 160,100 0,100 0,0
Copper layers (1*16): Top 0.035mm / dielectric 0.2mm / Bottom 0.035mm
Design rules "SparkFun-2-layer-PCBWay-LIMIT *": minimum track width 6mil, minimum drill 0.3mm, track to track 6mil, track to pad 6mil, pad to pad 6mil, via to via 6mil, smd to smd 6mil, copper to edge 6mil, drill to drill 6mil, minimum pad ring 6mil, minimum via ring 6mil, stop-mask expansion 4mil, vias tented up to drill 25mil, thermal gap 10mil
tKeepout: area 24.1,12.7 to 44.5,15.2

### Footprints (pad centres in the part's own frame; a part is rotated, then mirrored left to right if it is on the bottom)
0603 = smd 1.1 x 1: 1 -0.85,0; 2 0.85,0
SOD-323 = smd 0.63 x 0.83: A 1.15,0; C -1.15,0
SOT886 = smd 0.61 x 0.25: 1 -0.405,0.5 | smd 0.56 x 0.25: 2 -0.43,0; 3 -0.43,-0.5; 4 0.43,-0.5; 5 0.43,0; 6 0.43,0.5
LED-0603 = smd 1 x 1: A -0.877,0; C 0.877,0
SPH0641LM4H-1_MICROPHONE = smd 0.725 x 0.522: 1 -0.9,1.3; 2 -0.9,0.3; 4 0.9,0.3; 5 0.9,1.3 | smd 0.5 x 0.2: 3 0,-1.65; 8 0,-0.35 | smd 0.2 x 0.5: 6 -0.65,-1; 7 0.65,-1 | hole 0.8: 0,-1
UDFN_2X3MM = smd 0.3 x 0.85: 1 -0.75,-1.45; 2 -0.25,-1.45; 3 0.25,-1.45; 4 0.75,-1.45; 5 0.75,1.45; 6 0.25,1.45; 7 -0.25,1.45; 8 -0.75,1.45 | smd 1.6 x 1.4: P 0,0
JST-2-SMD = smd 1 x 4.6: 1 -1,-3.7; 2 1,-3.7 | smd 1.6 x 3.4: NC1 -3.4,1.5; NC2 3.4,1.5
USB-C-16P = smd 0.3 x 1.016: A5 -1.25,0.154; A6 -0.25,0.154; A7 0.25,0.154; A8 1.25,0.154; B5 1.75,0.154; B6 0.75,0.154; B7 -0.75,0.154; B8 -1.75,0.154 | smd 0.6 x 1.016: GND -3.225,0.154; GND2 3.225,0.154 | smd 1 x 2.1: SHLD1 -4.32,-0.915; SHLD2 4.32,-0.915 | smd 1 x 2.1 bottom: SHLD3 -4.32,-0.915; SHLD4 4.32,-0.915 | smd 1 x 1.6: SHLD5 -4.32,-5.095; SHLD8 4.32,-5.095 | smd 1 x 1.6 bottom: SHLD6 -4.32,-5.095; SHLD7 4.32,-5.095 | smd 0.55 x 1.016: VBUS1 -2.45,0.154; VBUS2 2.45,0.154 | hole 0.65: -2.89,-1.445; 2.89,-1.445
2X5-PTH-1.27MM = drill 0.508 pad 1: 1 -2.54,-0.635; 2 -2.54,0.635; 3 -1.27,-0.635; 4 -1.27,0.635; 5 0,-0.635; 6 0,0.635; 7 1.27,-0.635; 8 1.27,0.635; 9 2.54,-0.635; 10 2.54,0.635
2X5-PTH-1.27MM-NO_SILK = drill 0.508 pad 1: 1 -2.54,-0.635; 2 -2.54,0.635; 3 -1.27,-0.635; 4 -1.27,0.635; 5 0,-0.635; 6 0,0.635; 7 1.27,-0.635; 8 1.27,0.635; 9 2.54,-0.635; 10 2.54,0.635
1X08_NO_SILK = drill 1.016 pad 1.88: 1 0,0; 2 2.54,0; 3 5.08,0; 4 7.62,0; 5 10.16,0; 6 12.7,0; 7 15.24,0; 8 17.78,0
1X07_NO_SILK = drill 1.016 pad 1.88: 1 0,0; 2 2.54,0; 3 5.08,0; 4 7.62,0; 5 10.16,0; 6 12.7,0; 7 15.24,0
FPC-24-AMPHENOL-SFV24R-1STE1HLF = smd 0.3 x 1.4: 1 5.75,2.4; 2 5.25,2.4; 3 4.75,2.4; 4 4.25,2.4; 5 3.75,2.4; 6 3.25,2.4; 7 2.75,2.4; 8 2.25,2.4; 9 1.75,2.4; 10 1.25,2.4; 11 0.75,2.4; 12 0.25,2.4; 13 -0.25,2.4; 14 -0.75,2.4; 15 -1.25,2.4; 16 -1.75,2.4; 17 -2.25,2.4; 18 -2.75,2.4; 19 -3.25,2.4; 20 -3.75,2.4; 21 -4.25,2.4; 22 -4.75,2.4; 23 -5.25,2.4; 24 -5.75,2.4 | smd 1.4 x 1.6: MNT1@0 -8.15,1.5; MNT2@1 8.15,1.5 | smd 1.25 x 2.3: MNT1@1 -6.825,1.15; MNT2@0 6.825,1.15
JST04_1MM_RA = smd 0.6 x 1.35: 1 -1.5,0; 2 -0.5,0; 3 0.5,0; 4 1.5,0 | smd 1.2 x 2: NC1 2.8,-3.675; NC2 -2.8,-3.675
SMT-JUMPER_3_1-NC_TRACE_SILK = smd 0.635 x 1.27: 1 -1.016,0; 2 0,0; 3 1.016,0
TACTILE_SWITCH_SMD_4.6X2.8MM = smd 0.9 x 1: 1 -2.05,-0.8; 2 2.05,-0.8; 3 2.05,0.8; 4 -2.05,0.8
PAD.03X.05 = smd 1.27 x 1.27: P$1 0,0
QFN-32-NOPAD = smd 0.285 x 0.8: 1 -1.75,-2.5; 2 -1.25,-2.5; 3 -0.75,-2.5; 4 -0.25,-2.5; 5 0.25,-2.5; 6 0.75,-2.5; 7 1.25,-2.5; 8 1.75,-2.5; 17 1.75,2.5; 18 1.25,2.5; 19 0.75,2.5; 20 0.25,2.5; 21 -0.25,2.5; 22 -0.75,2.5; 23 -1.25,2.5; 24 -1.75,2.5 | smd 0.8 x 0.285: 9 2.5,-1.75; 10 2.5,-1.25; 11 2.5,-0.75; 12 2.5,-0.25; 13 2.5,0.25; 14 2.5,0.75; 15 2.5,1.25; 16 2.5,1.75; 25 -2.5,1.75; 26 -2.5,1.25; 27 -2.5,0.75; 28 -2.5,0.25; 29 -2.5,-0.25; 30 -2.5,-0.75; 31 -2.5,-1.25; 32 -2.5,-1.75
CRYSTAL-SMD-3.2X2.5MM = smd 1.2 x 1.1: 1 -1.175,-0.875; 2 1.175,-0.875; 3 1.175,0.875; 4 -1.175,0.875
ARTEMIS_FP = smd 0.4 x 0.6: AD16 -4,-3.7; BOOT 1.5,4.5; D0 0.5,-4.5; D1 -0.5,-4.5; D2 -1,-3.7; D3 2,-3.7; D7 -1.5,4.5; D8 -0.5,4.5; D9 2,3.7; D10 1,3.7; D14 -5,3.7; D17 -3.5,-4.5; D36 2.5,-4.5; D38 3,-3.7; D40 2.5,4.5; D41 -2.5,-4.5; GND@1 4.5,4.5; GND@39 -5.5,-4.5; GND@47 -1.5,-4.5; GND@59 4.5,-4.5; RXI-0 3.5,4.5; SWDCK 4,3.7; SWDIO 0,3.7; TXO-0 0.5,4.5; ~AD31 -3,-3.7; ~AD35 -2,3.7; ~D4 -2.5,4.5; ~D5 -1,3.7; ~D18 -4.5,-4.5; ~D19 -5,-3.7; ~D22 -3.5,4.5; ~D23 -4,3.7; ~D24 -3,3.7; ~D27 -4.5,4.5; ~D28 -5.5,4.5; ~D37 3.5,-4.5; ~D39 3,3.7; ~D42 1.5,-4.5; ~D43 1,-3.7; ~D44 4,-3.7; ~D45 -2,-3.7; ~RST 0,-3.7 | smd 0.6 x 0.4: AD34 -6.5,-0.5; D15 -6.5,0.5; VDD@36 -5.7,-3; VDD@37 -6.5,-3.5; XI -6.5,-2.5; XO -5.7,-2; ~AD11 -5.7,-1; ~AD12 -5.7,2; ~AD13 -5.7,1; ~AD29 -6.5,-1.5; ~AD32 -5.7,3; ~AD33/SWO -5.7,0; ~D6 -6.5,3.5; ~D25 -6.5,2.5; ~D26 -6.5,1.5 | smd 0.6 x 0.6: GND@22 -6.5,4.5; GND@38 -6.5,-4.5
SOT23-5 = smd 0.55 x 1.2: 1 -0.95,-1.3; 2 0,-1.3; 3 0.95,-1.3; 4 0.95,1.3; 5 -0.95,1.3
LGA-12-LISDH12 = smd 0.275 x 0.25: 1 -0.75,0.75; 2 -0.75,0.25; 3 -0.75,-0.25; 4 -0.75,-0.75; 7 0.75,-0.75; 8 0.75,-0.25; 9 0.75,0.25; 10 0.75,0.75 | smd 0.25 x 0.275: 5 -0.25,-0.75; 6 0.25,-0.75; 11 0.25,0.75; 12 -0.25,0.75
CRYSTAL-SMD-3.2X1.5MM = smd 1 x 1.8: P$1 -1.25,0; P$2 1.25,0

### Placement (x,y rotation side)
C1  82.55,22.86 0 top
C2  96.52,40.64 0 bottom
C3  92.71,40.64 0 bottom
C4  88.9,40.64 0 bottom
C5  54.61,15.49 0 bottom
C6  10.41,1.78 90 bottom
C7  7.37,1.78 90 bottom
C8  8.89,1.78 90 bottom
C9  21.46,3.68 0 bottom
C10  21.46,5.97 180 bottom
C11  24,4.83 270 bottom
C12  16.89,10.54 90 bottom
C13  15.37,10.54 90 bottom
C14  34.04,1.4 0 top
C15  68.58,32 0 top
C16  37.34,12.95 270 bottom
C17  29.21,8.13 90 bottom
C18  27.69,8.13 90 bottom
C19  38.86,12.95 90 bottom
C21  89.03,43.81 0 top
D1  8.64,10.16 180 top
D2  8.64,11.56 180 top
D3  9.02,6.35 0 top
D4  15.88,18.16 270 top
D5  14.35,18.16 270 top
D6  12.83,18.16 270 top
D7  11.3,18.16 270 top
E2  31.75,9.53 180 bottom
ECC1  31.11,2.67 0 top
FRAME1  26.67,-12.7 0 top  (outside the outline)
J1  3.81,16.51 90 top
J2  6.35,6.35 270 top
J3  46.99,17.78 90 top
J4  14.73,1.65 0 top
J5  25.4,18.41 0 top
J6  26.67,20.32 0 top
J7  39.37,2.54 0 bottom
J8  26.29,5.08 0 top
J9  26.67,16.51 0 top
JP1  57.4,14.48 90 bottom
R1  78.74,22.86 0 top
R2  25.53,4.83 90 bottom
R3  54.61,17.02 0 bottom
R4  41.91,12.95 90 bottom
R5  43.43,12.95 90 bottom
R6  40.39,12.95 90 bottom
R7  3.81,3.81 90 bottom
R8  3.81,8.89 270 bottom
R9  24.13,10.54 270 bottom
R10  22.35,10.54 90 bottom
R11  25.91,10.54 90 bottom
R12  18.41,10.54 90 bottom
R13  20.32,10.54 90 bottom
R14  13.84,10.54 270 bottom
R15  12.32,4.7 90 bottom
R16  15.62,4.7 90 bottom
R17  17.4,4.7 90 bottom
R18  13.84,4.7 90 bottom
R19  18.92,4.7 270 bottom
R20  28.83,4.83 90 bottom
R21  27.3,4.83 90 bottom
R22  44.96,12.95 90 bottom
R23  9.27,4.57 0 top
R24  12.32,10.54 270 bottom
R25  15.88,18.16 270 bottom
R26  14.35,18.16 270 bottom
R27  12.83,18.16 270 bottom
R28  11.3,18.16 270 bottom
R29  9.14,8.13 0 top
R30  35.18,10.16 0 bottom
S2  20.32,15.24 0 top
S3  20.32,19.05 180 top
TP1  31.75,12.45 0 bottom
TP2  46.48,13.72 0 bottom
TP3  18.67,8.26 0 bottom
TP4  20.19,8.26 0 bottom
TP5  21.72,8 0 bottom
TP9  3.81,1.02 0 bottom
TP10  15.37,12.95 0 bottom
TP11  83.19,27.43 0 bottom
TP12  10.16,12.95 0 bottom
TP13  79.12,20.19 0 bottom
U1  14.73,6.35 270 top
U2  21.46,4.83 90 top
U3  43.18,6.35 0 top
U4  35.18,12.95 0 bottom
U5  31.11,6.48 90 top
Y1  34.42,4.06 270 top

### Tracks (layer width: path | path; a pad name or v marks a point on that pad's centre or on a via)
1.8V  (1 unrouted)
  Bottom 0.203: C16.1 36.89,14.25 U4.5 36.13,13.9 35.05,12.83 32.13,12.83 TP1.P$1
3.3V  (via drill 0.3)  (3 unrouted)
  Top 0.203: U1.15 15.98,7.28 v15.27,7.99 15.27,7.63 12.74,5.1 U1.7 11.42,5.1 v11.29,4.97 11.48,5.16 11.48,5.89 11.69,6.1 U1.5
  Top 0.406: D1.A 8.53,10.16 v8.76,9.93 | v21.34,11.43 v26.92,11.43
  Bottom 0.203: 13.84,5.33 13.84,5.46 R18.2 | v11.29,4.97 11.3,4.95 | R2.2 25.53,7.77 26.79,9.04 26.79,10.29 26.92,10.42 v26.92,11.43
  Bottom 0.406: R15.2 12.53,5.33 | R17.2 R16.2 13.93,5.55 13.84,5.46 | R18.2 R15.2 | R15.2 11.72,4.95 11.3,4.95 | 8.76,9.91 8.76,5.84 9.65,4.95 11.3,4.95 | 11.3,4.95 11.3,1.91 J4.1 12.1,0.93 C6.1 C8.1 C7.1 | R26.2 14.35,17.46 | 8.76,9.91 11.3,12.45 R28.2 R27.2 R26.2 | R26.2 R25.2 | v8.76,9.93 8.76,9.91 | R10.2 21.38,11.39 v21.34,11.43 | v26.92,11.43 26.89,11.39 R11.2
!RST  (via drill 0.3)
  Top 0.203: U1.19 18.14,5.6 v19.23,6.68 20.29,7.75 23.62,7.75 v23.88,7.49 | v14.22,8 14.11,8.12 13.22,8.12 12.98,8.35 U1.32 12.98,12.29 v12.57,12.7
  Bottom 0.203: J4.10 17.4,2.29 18.92,3.81 R19.2 18.94,3.83 19.73,4.62 19.73,6.17 v19.23,6.68 19.23,6.94 18.82,7.34 14.88,7.34 v14.22,8 | v12.57,12.7 13.72,12.7 13.84,12.57 R14.1 | v23.88,7.49 24,7.37 C11.1
!TGT_RST  (via drill 0.3)  (4 unrouted)
  Top 0.203: U1.21 17.78,6.6 19.94,8.76 v23.24,8.76 | S3.3 S3.4 22.37,17.15 v22.38,17.14
  Bottom 0.203: R9.2 25.02,10.58 25.02,14.5 v22.38,17.14
  Bottom 0.406: R9.2 23.24,8.8 v23.24,8.76
!TGT_RST!_HW  (6 unrouted)
!TGT_RST!_SW  (1 unrouted)
CAMERA_D0  (1 unrouted)
CAMERA_D1  (via drill 0.3)  (1 unrouted)
  Top 0.203: U3.~D39 46.18,9.57 v46.61,9.14
CAMERA_D2  (via drill 0.3)  (1 unrouted)
  Top 0.203: U3.D40 45.68,9.28 v45.85,9.12
CAMERA_D3  (1 unrouted)
CAMERA_D4  (1 unrouted)
CAMERA_D5  (1 unrouted)
CAMERA_D6  (1 unrouted)
CAMERA_D7  (1 unrouted)
CAMERA_DVDD_EN  (2 unrouted)
CAMERA_HSYNC  (1 unrouted)
CAMERA_INT  (1 unrouted)
CAMERA_MCLK  (1 unrouted)
CAMERA_PCLK  (1 unrouted)
CAMERA_TRIG  (1 unrouted)
CAMERA_VSYNC  (1 unrouted)
D3_PWM_UARTTX  (1 unrouted)
D4_MISO  (1 unrouted)
D5_MOSI_CLKOUT  (1 unrouted)
D6_SCLK  (1 unrouted)
D7  (1 unrouted)
D8  (1 unrouted)
D9  (1 unrouted)
D10  (1 unrouted)
D11  (1 unrouted)
D12  (1 unrouted)
D13  (1 unrouted)
GND  (via drill 0.3)  (64 unrouted)
  Top 0.203: D3.2 v7.85,6.35 | v16.26,8 16.48,7.78 U1.16 20.39,3.85 U2.4 20.59,2.55 v20.57,2.54 | U2.2 22.34,7.1 v22.35,7.11 | U1.8 11.71,4.6 11.3,4.19 11.3,3.94 10.92,3.56 v9.65,3.56 | U5.8 U5.7 | U5.7 U5.6 U5.5 | U5.7 32.4,7.23 v32.64,6.99
  Top 0.406: v4.57,17.53 4.59,17.51 J1.2 11.08,17.51 D7.C
  Bottom 0.203: v22.35,7.11 22.35,6.01 C10.2 | v20.57,2.54 20.57,3.64 C9.2 | C19.2 37.34,12.28 C16.2
  Bottom 0.406: C12.2 C13.2 | C7.2 C8.2 C6.2
  other vias: 11.3,8
LED_HID
  Top 0.203: 14.49,17.14 14.42,17.21 | 14.42,17.21 D5.C | U1.30 13.98,15.89 14.42,16.33 14.42,17.21
LED_MSD
  Top 0.203: U1.29 14.48,15.12 15.88,16.51 D4.C
LED_UART
  Top 0.203: U1.31 13.48,15.86 12.83,16.51 D6.C
N$1  (via drill 0.3)
  Top 0.406: v15.88,20.19 D4.A
  Bottom 0.406: R25.1 v15.88,20.19
N$2  (via drill 0.3)
  Top 0.406: D5.A v14.35,20.19
  Bottom 0.406: v14.35,20.19 R26.1
N$3  (via drill 0.3)
  Top 0.406: v12.83,20.19 D6.A
  Bottom 0.406: R27.1 v12.83,20.19
N$4  (via drill 0.3)
  Top 0.203: J2.B5 5.81,4.6 v5.33,5.08
  Bottom 0.406: v5.33,5.08 4.91,4.66 R7.2
N$5  (via drill 0.3)
  Top 0.203: J2.A5 5.61,7.6 v5.46,7.75
  Bottom 0.406: R8.2 5.17,8.04 v5.46,7.75
N$7  (via drill 0.3)
  Top 0.406: D7.A v11.3,20.19
  Bottom 0.406: v11.3,20.19 R28.1
N$8
  Top 0.203: D3.4 9.45,5.39 8.63,4.57 R23.1
N$9
  Top 0.203: D3.6 9.45,7.21 8.53,8.13 R29.1
N$10  (via drill 0.3)
  Top 0.203: U1.14 15.48,3.31 15.75,3.05 18.67,3.05 19.81,1.91 21.97,1.91 22.86,2.79 25.4,2.79 v25.53,2.67
  Bottom 0.203: v25.53,2.67 R2.1
N$11  (via drill 0.3)
  Top 0.203: U1.20 17.78,6.1 19.81,8.13 24.26,8.13 24.38,8.13 v25.02,8.76
  Bottom 0.406: R11.1 25.91,9.65 v25.02,8.76
N$13  (via drill 0.3)
  Top 0.203: U1.17 21.39,4.6 U2.1 22.34,3.16 v21.72,2.54
  Bottom 0.203: C9.1 22.31,3.14 v21.72,2.54
N$14
  Top 0.203: U3.XI 34.58,3.85 34.42,3.68 Y1.P$2 34.42,1.87 C14.2
N$15  (1 unrouted)
  Top 0.203: U3.XO 34.51,4.35 34.42,4.45 Y1.P$1
N$16  (via drill 0.3)
  Top 0.203: U1.18 19.69,5.1 U2.3 20.59,7.1 v20.57,7.11
  Bottom 0.203: C10.1 20.57,6.01 v20.57,7.11 21.46,8 TP5.P$1
N$17  (via drill 0.3)
  Top 0.203: U1.24 17.76,8.1 17.91,8.25 17.91,8.51 v17.65,8.76
  Bottom 0.406: R12.1 18.67,9.44 TP3.P$1 18.16,8.26 v17.65,8.76
N$18  (via drill 0.3)
  Top 0.203: U1.25 16.48,9.37 17.65,10.54 v19.37,10.54
  Bottom 0.406: v19.37,10.54 20.22,9.69 R13.1 20.32,8.38 TP4.P$1
N$19  (via drill 0.3)
  Top 0.203: U1.23 17.76,7.6 20.57,10.41 v21.34,10.41
  Bottom 0.406: R10.1 21.63,10.41 v21.34,10.41
N$20  (via drill 0.3)
  Top 0.203: U3.BOOT 44.68,10.9 v45.97,12.19
  Bottom 0.203: R22.2 46.39,13.8 TP2.P$1 46.48,12.7 v45.97,12.19
N$21  (via drill 0.3)
  Top 0.406: J1.1 4.84,15.51 4.57,15.24 4.57,11.81 4.83,11.56 D2.A v9.01,11.56
  Bottom 0.406: v9.01,11.56 9.62,11.56 10.16,12.09 TP12.P$1
N$22  (via drill 0.3)
  Top 0.203: U1.22 17.77,7.1 20.52,9.86 23.01,9.86 23.24,10.09 v23.24,10.54
  Bottom 0.406: R9.1 23.28,10.54 v23.24,10.54
N$23  (1 unrouted)
  Top 0.203: U1.26 15.98,10.65 17.67,12.34 20.95,12.34
N$24  (1 unrouted)
  Top 0.203: U1.27 15.48,10.66 17.53,12.7 21.21,12.7
N$25  (1 unrouted)
  Top 0.203: U1.28 14.98,10.79 17.27,13.08 21.46,13.08
PDM_CLK  (via drill 0.3)
  Top 0.203: U3.~AD12 v33.92,8.35 v33.91,8.36
  Bottom 0.203: v33.91,8.36 33.91,8.61 33.3,9.22 E2.4
PDM_DATA  (via drill 0.3)
  Top 0.203: U3.~AD11 36.31,5.35 34.06,7.59 v33.91,7.59
  Bottom 0.203: E2.1 30.85,7.75 31,7.59 v33.91,7.59
SCL  (via drill 0.3)  (1 unrouted)
  Top 0.203: v27.81,2.67 27.79,2.69 J8.4 27.79,6.33 30.37,8.91 34.29,8.91
  Bottom 0.203: v27.81,2.67 28.19,2.67 28.83,3.3 R20.1
SCL_INTERNAL  (via drill 0.3)  (1 unrouted)
  Top 0.203: ECC1.6 31.36,4.7 31.18,4.89 30.57,4.89 30.36,5.09 U5.1 29.72,5.08 v29.72,4.83 | U3.~D27 38.68,9.33 38.8,9.21 44.26,9.21 v44.32,9.14
  Bottom 0.203: J7.21 43.62,8.44 v44.32,9.14
SDA  (via drill 0.3)  (1 unrouted)
  Top 0.203: v26.8,2.67 v26.79,2.67 J8.3 26.79,6.21 29.84,9.27 34.29,9.27 | U3.D9 45.18,8.92 v44.99,8.73
  Bottom 0.203: v26.8,2.67 27.3,3.17 R21.1
SDA_INTERNAL  (via drill 0.3)  (1 unrouted)
  Top 0.203: U3.~D25 43.73,8.85 v44.32,8.26 | U5.4 ECC1.5
  Bottom 0.203: J7.22 44.12,8.05 v44.32,8.26
TCLK
  Top 0.203: U1.10 13.48,2.31 J4.4
  Bottom 0.203: R18.1 13.84,2.67 J4.4
TDI  (via drill 0.3)
  Top 0.203: U1.11 13.98,5.73 14.99,6.73 v15.37,6.73
  Bottom 0.203: J4.8 17.4,3.68 R17.1 18.16,4.61 18.16,6.35 17.78,6.73 v15.37,6.73
TDO
  Top 0.203: J4.6 14.48,2.54 U1.12
  Bottom 0.203: R16.1 15.62,3.17 J4.6
TGT_RX  (1 unrouted)
TGT_SWCLK  (via drill 0.3)  (1 unrouted)
  Top 0.203: U3.SWDCK 47.18,11.37 v48.77,12.95
  Bottom 0.203: R4.2 42.02,13.8 44.73,16.51 J3.4
TGT_SWDIO  (1 unrouted)
  Bottom 0.203: R5.2 43.43,14.69 43.98,15.24 J3.2
TGT_SWO  (1 unrouted)
  Bottom 0.203: R6.2 41.31,14.73 42.45,14.73 45.5,17.78 J3.6
TGT_TX  (via drill 0.3)  (1 unrouted)
  Top 0.203: U3.RXI-0 46.68,11.66 v47.99,12.97
TMS  (via drill 0.3)
  Top 0.203: U1.13 14.98,4.46 v14.73,4.71
  Bottom 0.203: J4.2 12.32,2.41 R15.1 13.18,4.71 v14.73,4.71
USB_D+_P  (via drill 0.3)
  Top 0.203: U1.3 11.19,7.1 v11.05,7.24 | R23.2 10.12,5.42 10.54,5.84 v10.92,5.84
  Bottom 0.203: v11.05,7.24 10.92,7.11 v10.92,5.84
USB_D+_R
  Top 0.203: D3.3 8.34,5.6 7.24,5.6 | 7.24,5.6 J2.B6 | J2.A6 7.17,6.6 7.29,6.48 7.29,5.65 7.24,5.6
USB_D-_P
  Top 0.203: R29.2 10.34,7.78 10.34,7.11 10.85,6.6 U1.4
USB_D-_R
  Top 0.203: J2.A7 5.84,6.1 5.71,6.22 5.71,6.99 5.83,7.1 J2.B7 8.36,7.1 D3.1
VBUS_IF  (via drill 0.3)
  Top 0.203: 9.53,6.35 D3.5 v10.29,6.35
  Top 0.406: J2.VBUS2 5.58,3.9 4.57,4.91 4.57,7.87 5.5,8.8 J2.VBUS1 7.15,8.8 7.62,9.27 v10.16,9.27
  Bottom 0.406: v10.29,6.35 10.29,9.14 v10.16,9.27 10.16,9.91 11.64,11.39 R24.1
VBUS_IF2  (via drill 0.3)
  Top 0.203: U1.6 12.74,5.6 13.97,6.83 v13.97,7.24
  Bottom 0.406: C12.1 C13.1 R14.2 R24.2 12.32,8.89 v13.97,7.24
VDD  (via drill 0.3)  (15 unrouted)
  Top 0.203: U5.9 U5.2 U5.3 | U5.9 U5.10 30.24,7.11 30.12,7.11 29.77,6.75 v29.77,6.22 | 32,8.26 v31.75,8.26 31.62,8.26 30.86,7.5 U5.9
  Top 0.406: D1.C D2.C 9.79,12.2 11.05,13.46 v12.92,13.46
  Bottom 0.203: E2.5 32.62,8.26 v31.75,8.26 | C19.1 38.86,12.06 37.97,11.18 36.23,11.18 36.13,11.27 U4.1 | v29.77,6.22 29.77,5.97 29.48,5.68 R20.2
  Bottom 0.406: v12.92,13.46 14.73,13.46 15.24,12.95 TP10.P$1 15.49,12.95 16,13.46 18.54,13.46 | C18.1 C17.1 28.83,6.9 R20.2 R21.2 27.3,6.9 C18.1